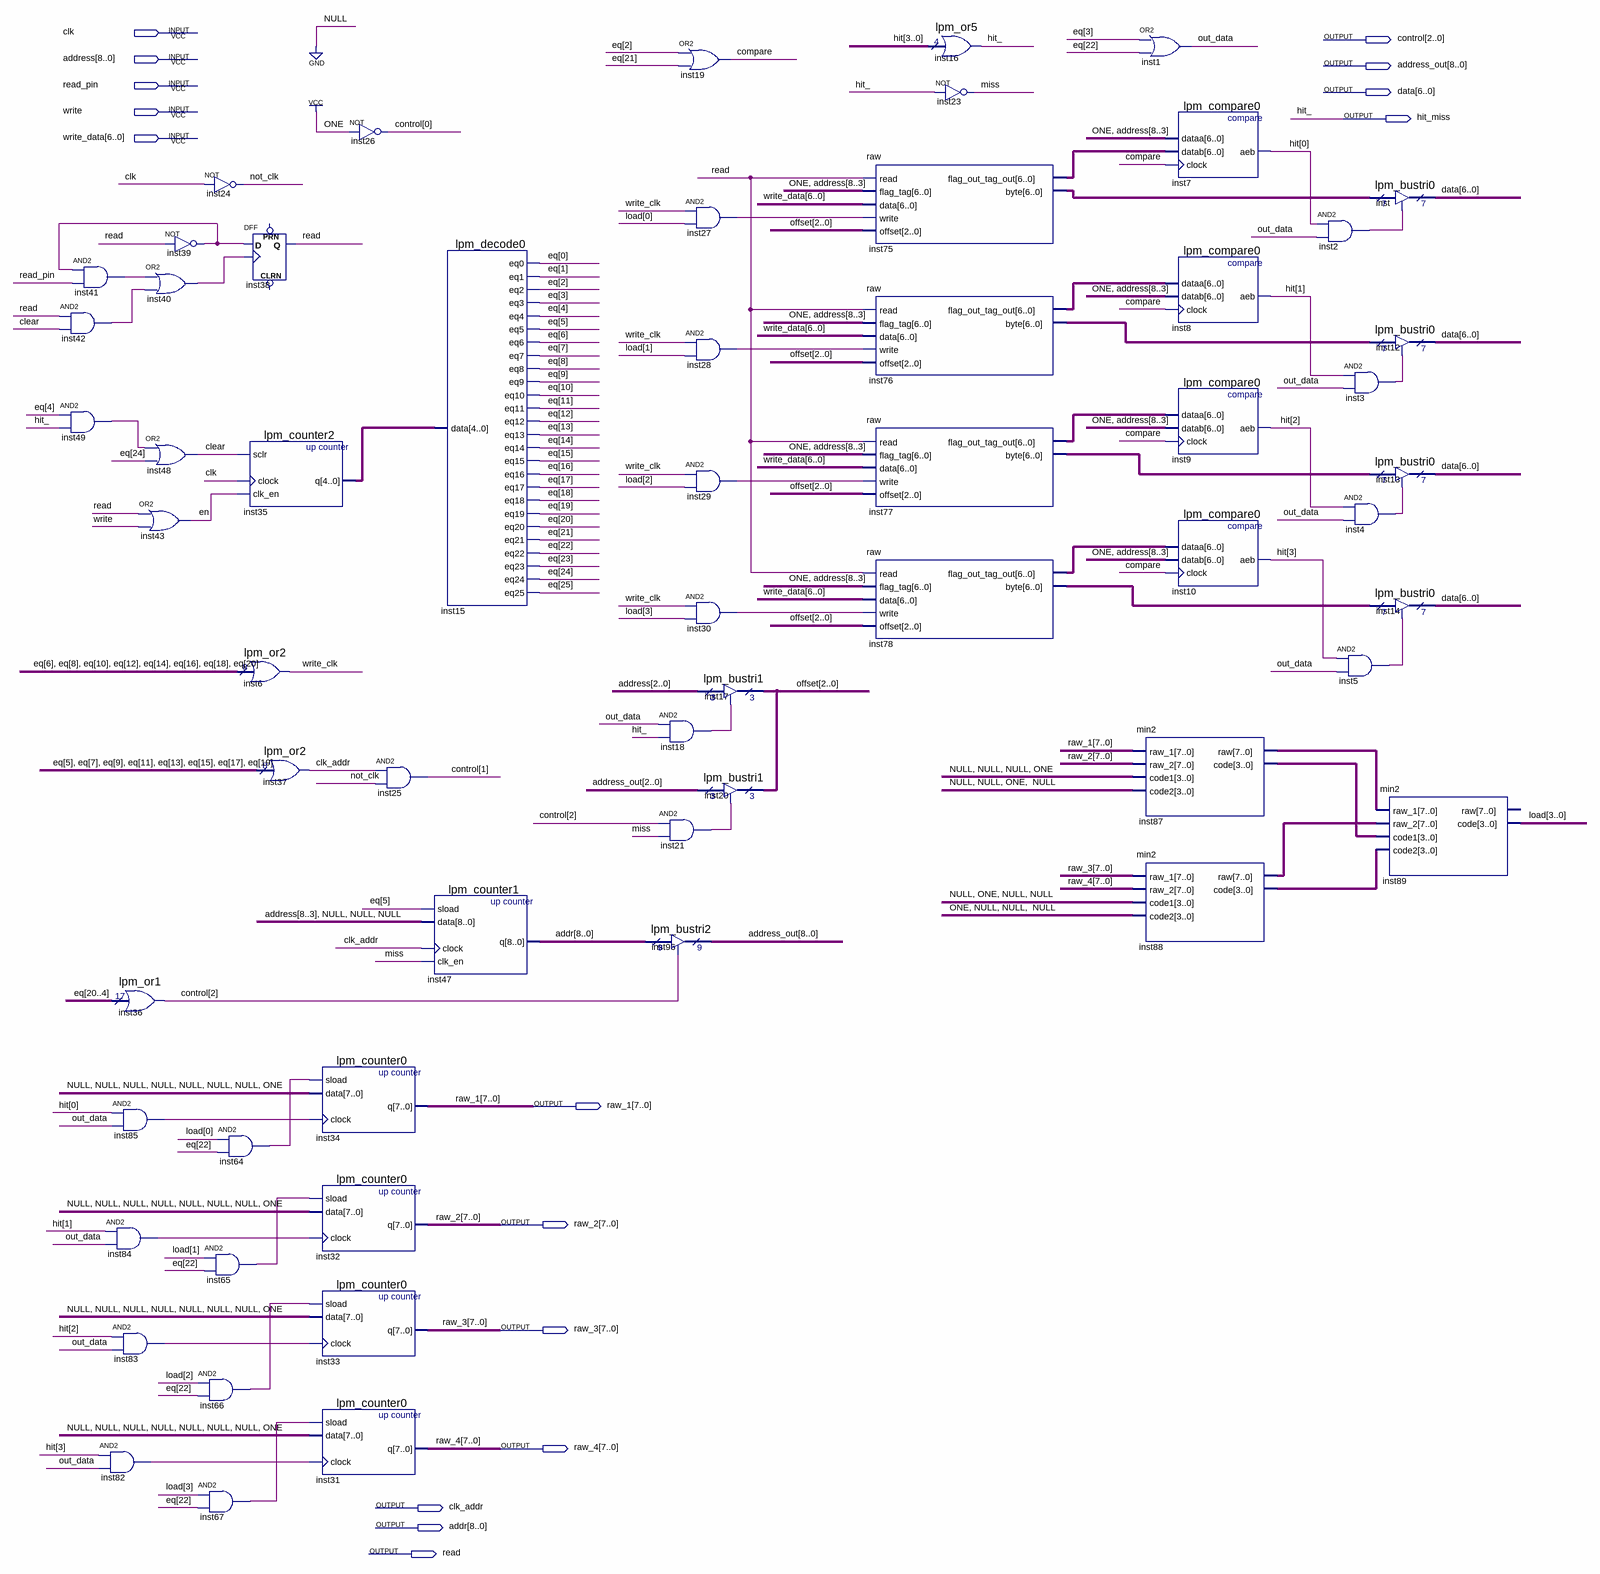
[diagram p0: schematic sheet]
// Quartus schematic cash_temple.bdf as structural Verilog: 61 symbols, 16 pins
module cash_temple (
  input  clk,
  input  [8:0] address,
  input  read_pin,
  input  write,
  input  [6:0] write_data,
  output [2:0] control,
  output [8:0] address_out,
  output [6:0] data,
  output hit_miss,
  output [7:0] raw_1,
  output [7:0] raw_2,
  output [7:0] raw_3,
  output [7:0] raw_4,
  output clk_addr,
  output [8:0] addr,
  output read
);

  wire clear, compare, en, inst2_out, inst3_out, inst4_out, inst5_out, inst18_out, inst21_out, inst27_out,
       inst28_out, inst29_out, inst30_out, inst39_out, inst40_out, inst41_out, inst42_out, inst49_out,
       inst64_out, inst65_out, inst66_out, inst67_out, inst82_out, inst83_out, inst84_out, inst85_out, miss,
       not_clk, out_data, write_clk;
  wire [2:0] offset;
  wire [3:0] hit, inst87_code, inst88_code, load;
  wire [4:0] inst35_q;
  wire [6:0] inst75_byte, inst75_flag_out_tag_out, inst76_byte, inst76_flag_out_tag_out, inst77_byte,
       inst77_flag_out_tag_out, inst78_byte, inst78_flag_out_tag_out;
  wire [7:0] inst87_raw, inst88_raw;
  wire [25:0] eq;

  and inst41 (inst41_out, inst39_out, read_pin);
  and inst42 (inst42_out, read, clear);
  and inst49 (inst49_out, eq[4], hit_miss);
  and inst82 (inst82_out, hit[3], out_data);
  or inst40 (inst40_out, inst41_out, inst42_out);
  or inst48 (clear, inst49_out, eq[24]);
  or inst43 (en, read, write);
  lpm_or1 inst36 (.data(eq[20:4]), .result(control[2]));
  and inst85 (inst85_out, hit[0], out_data);
  and inst84 (inst84_out, hit[1], out_data);
  and inst83 (inst83_out, hit[2], out_data);
  not inst24 (not_clk, clk);
  not inst39 (inst39_out, read);
  and inst65 (inst65_out, load[1], eq[22]);
  and inst66 (inst66_out, load[2], eq[22]);
  and inst67 (inst67_out, load[3], eq[22]);
  DFF inst38 (.CLK(inst40_out), .D(inst39_out), .Q(read));  // open: CLRN, PRN
  lpm_counter2 inst35 (.sclr(clear), .clock(clk), .clk_en(en), .q(inst35_q));
  lpm_or2 inst6 (.data({eq[6], eq[8], eq[10], eq[12], eq[14], eq[16], eq[18], eq[20]}), .result(write_clk));
  lpm_or2 inst37 (.data({eq[5], eq[7], eq[9], eq[11], eq[13], eq[15], eq[17], eq[19]}), .result(clk_addr));
  and inst64 (inst64_out, load[0], eq[22]);
  lpm_counter0 inst34 (.sload(inst64_out), .data(8'b00000001), .clock(inst85_out), .q(raw_1));
  lpm_counter0 inst32 (.sload(inst65_out), .data(8'b00000001), .clock(inst84_out), .q(raw_2));
  lpm_counter0 inst33 (.sload(inst66_out), .data(8'b00000001), .clock(inst83_out), .q(raw_3));
  lpm_counter0 inst31 (.sload(inst67_out), .data(8'b00000001), .clock(inst82_out), .q(raw_4));
  not inst26 (control[0], 1'b1);
  and inst25 (control[1], clk_addr, not_clk);
  lpm_decode0 inst15 (
    .data(inst35_q), .eq0(eq[0]), .eq1(eq[1]), .eq2(eq[2]), .eq3(eq[3]), .eq4(eq[4]), .eq5(eq[5]),
    .eq6(eq[6]), .eq7(eq[7]), .eq8(eq[8]), .eq9(eq[9]), .eq10(eq[10]), .eq11(eq[11]), .eq12(eq[12]),
    .eq13(eq[13]), .eq14(eq[14]), .eq15(eq[15]), .eq16(eq[16]), .eq17(eq[17]), .eq18(eq[18]), .eq19(eq[19]),
    .eq20(eq[20]), .eq21(eq[21]), .eq22(eq[22]), .eq23(eq[23]), .eq24(eq[24]), .eq25(eq[25]));
  lpm_counter1 inst47 (.sload(eq[5]), .data({address[8:3], 3'b000}), .clock(clk_addr), .clk_en(miss), .q(addr));
  or inst19 (compare, eq[2], eq[21]);
  and inst18 (inst18_out, out_data, hit_miss);
  and inst21 (inst21_out, control[2], miss);
  lpm_bustri2 inst96 (.enabledt(control[2]), .data(addr), .tridata(address_out));
  and inst27 (inst27_out, write_clk, load[0]);
  and inst28 (inst28_out, write_clk, load[1]);
  and inst29 (inst29_out, write_clk, load[2]);
  and inst30 (inst30_out, write_clk, load[3]);
  lpm_bustri1 inst17 (.enabledt(inst18_out), .data(address[2:0]), .tridata(offset));
  lpm_bustri1 inst20 (.enabledt(inst21_out), .data(address_out[2:0]), .tridata(offset));
  raw inst75 (
    .read(read), .flag_tag({1'b1, address[8:3]}), .data(write_data), .write(inst27_out), .offset(offset),
    .flag_out_tag_out(inst75_flag_out_tag_out), .\byte (inst75_byte));
  raw inst76 (
    .read(read), .flag_tag({1'b1, address[8:3]}), .data(write_data), .write(inst28_out), .offset(offset),
    .flag_out_tag_out(inst76_flag_out_tag_out), .\byte (inst76_byte));
  raw inst77 (
    .read(read), .flag_tag({1'b1, address[8:3]}), .data(write_data), .write(inst29_out), .offset(offset),
    .flag_out_tag_out(inst77_flag_out_tag_out), .\byte (inst77_byte));
  raw inst78 (
    .read(read), .flag_tag({1'b1, address[8:3]}), .data(write_data), .write(inst30_out), .offset(offset),
    .flag_out_tag_out(inst78_flag_out_tag_out), .\byte (inst78_byte));
  lpm_or5 inst16 (.data(hit), .result(hit_miss));
  not inst23 (miss, hit_miss);
  or inst1 (out_data, eq[3], eq[22]);
  min2 inst87 (.raw_1(raw_1), .raw_2(raw_2), .code1(4'b0001), .code2(4'b0010), .raw(inst87_raw), .code(inst87_code));
  min2 inst88 (.raw_1(raw_3), .raw_2(raw_4), .code1(4'b0100), .code2(4'b1000), .raw(inst88_raw), .code(inst88_code));
  lpm_compare0 inst7 (.dataa({1'b1, address[8:3]}), .datab(inst75_flag_out_tag_out), .clock(compare), .aeb(hit[0]));
  lpm_compare0 inst8 (.dataa(inst76_flag_out_tag_out), .datab({1'b1, address[8:3]}), .clock(compare), .aeb(hit[1]));
  lpm_compare0 inst9 (.dataa(inst77_flag_out_tag_out), .datab({1'b1, address[8:3]}), .clock(compare), .aeb(hit[2]));
  lpm_compare0 inst10 (.dataa(inst78_flag_out_tag_out), .datab({1'b1, address[8:3]}), .clock(compare), .aeb(hit[3]));
  and inst2 (inst2_out, hit[0], out_data);
  and inst3 (inst3_out, hit[1], out_data);
  and inst4 (inst4_out, hit[2], out_data);
  and inst5 (inst5_out, hit[3], out_data);
  lpm_bustri0 inst (.enabledt(inst2_out), .data(inst75_byte), .tridata(data));
  lpm_bustri0 inst12 (.enabledt(inst3_out), .data(inst76_byte), .tridata(data));
  lpm_bustri0 inst13 (.enabledt(inst4_out), .data(inst77_byte), .tridata(data));
  lpm_bustri0 inst14 (.enabledt(inst5_out), .data(inst78_byte), .tridata(data));
  min2 inst89 (
    .raw_1(inst87_raw), .raw_2(inst88_raw), .code1(inst87_code), .code2(inst88_code), .code(load));  // open: raw

  // Other names for the same wires on the sheet: hit_ = hit_miss
endmodule
